# EAGLE design moth_v2 (EAGLE 9.4.1)
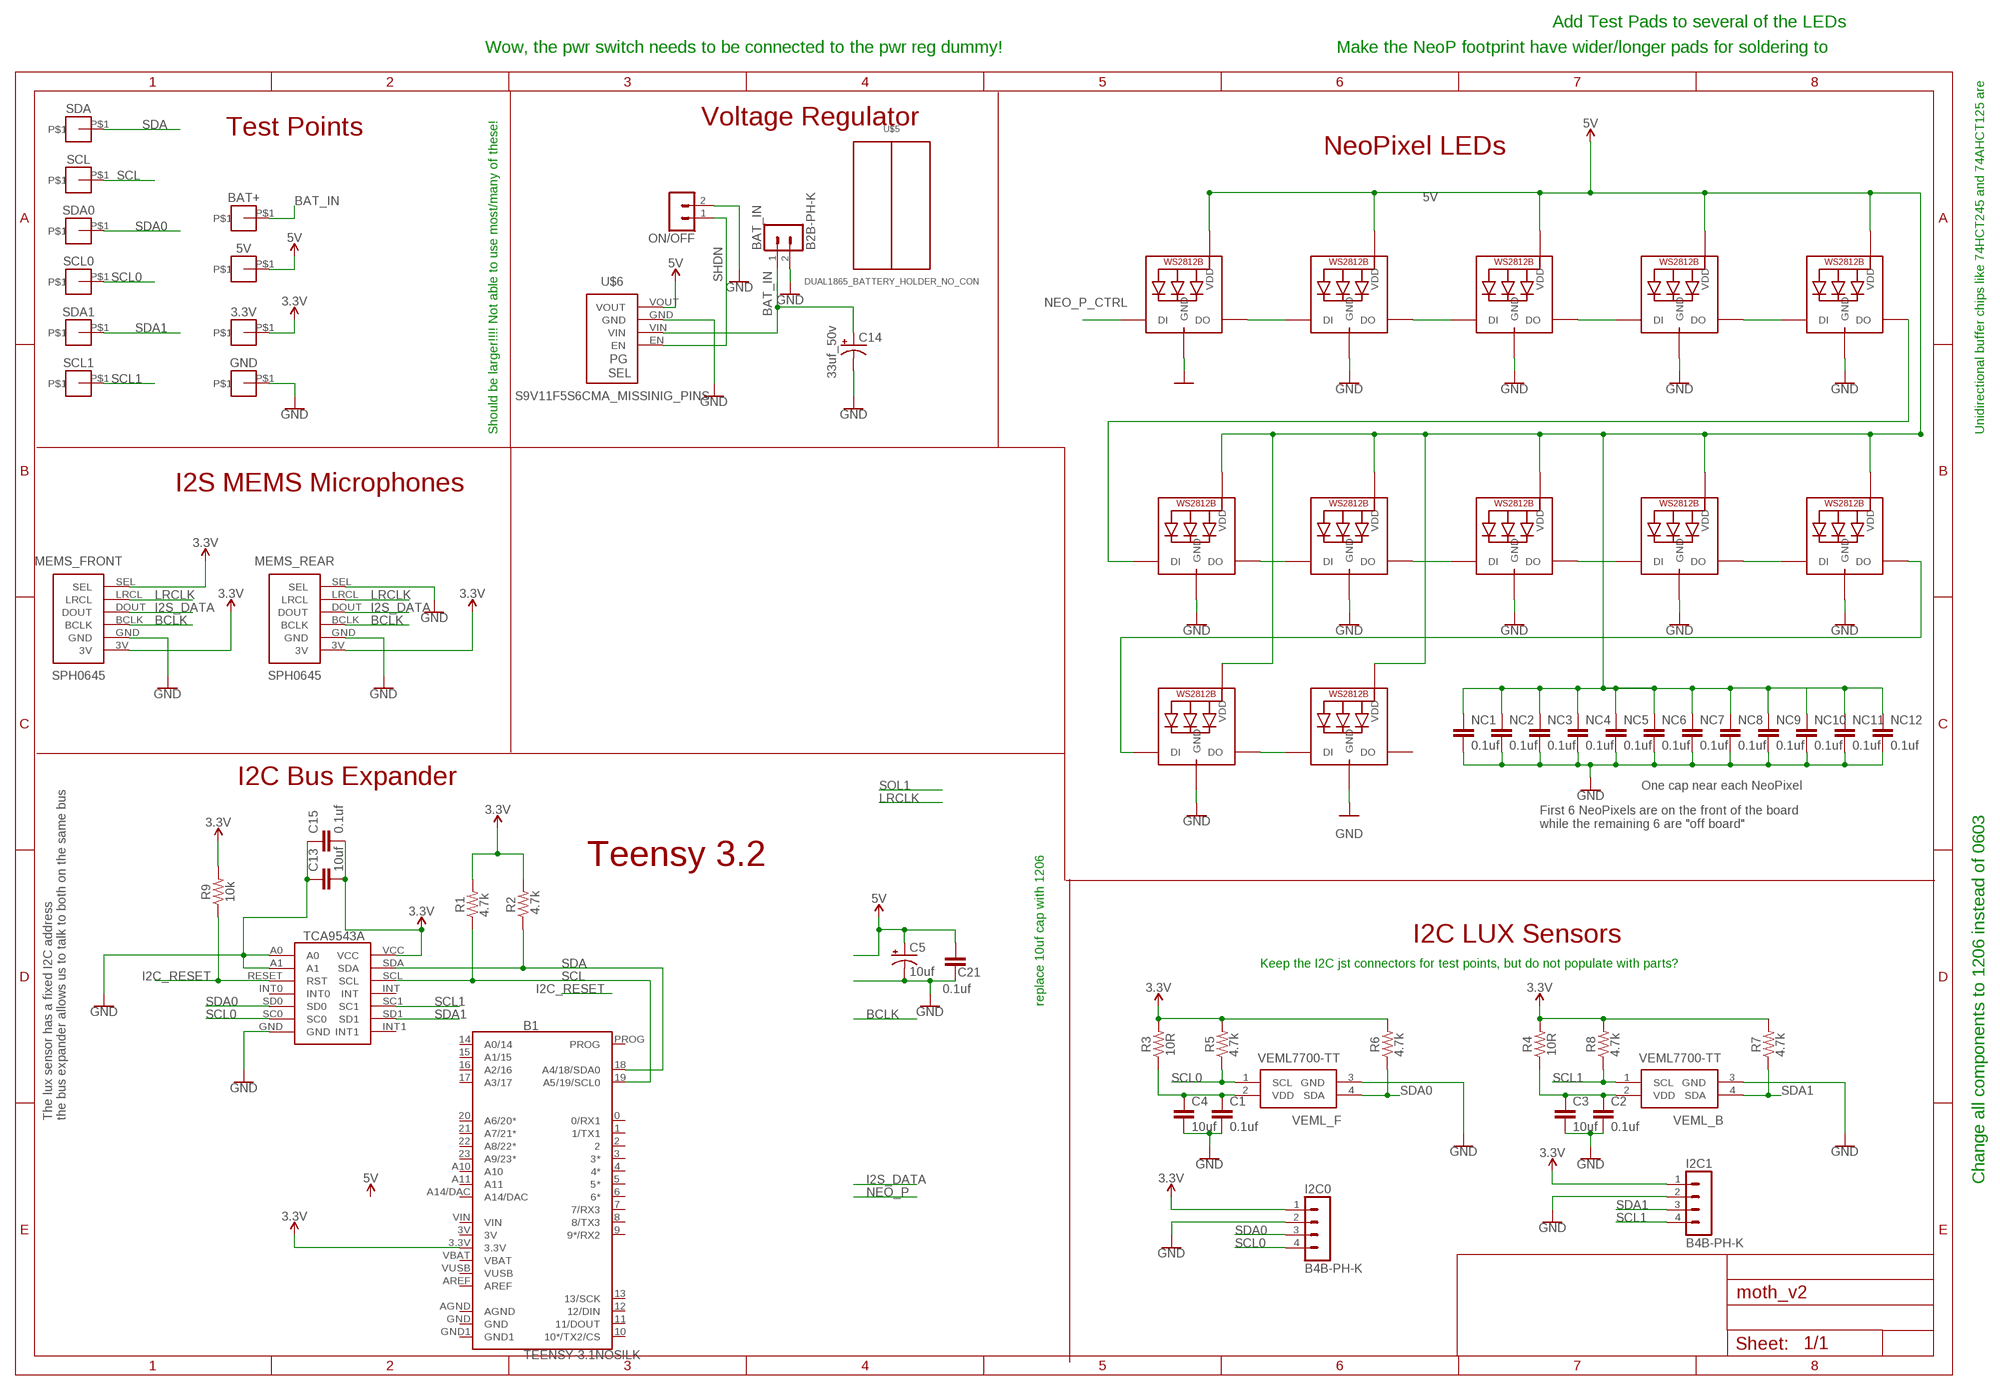
[diagram p0: schematic, sheet 1]

## Parts
3.3V  TEST_POINT_LARGE  [TEST_POINT_LARGE]
5V  TEST_POINT_LARGE  [TEST_POINT_LARGE]
B1  TEENSY-3.1NOSILK  [TEENSY-3.1_NOSILK]
BAT+  TEST_POINT_LARGE  [TEST_POINT_LARGE]
BAT_IN  B2B-PH-K  [B2B-PH-K]
C1  0.1uf  5.6PF-0603-50V-5%  [0603]
C2  0.1uf  5.6PF-0603-50V-5%  [0603]
C3  10uf  5.6PF-0603-50V-5%  [0603]
C4  10uf  5.6PF-0603-50V-5%  [0603]
C5  10uf  CPOL-USE2.5-6  [E2,5-6]
C13  10uf  5.6PF-0603-50V-5%  [0603]
C14  33uf_50v  CPOL-USE2-5  [E2-5]
C15  0.1uf  5.6PF-0603-50V-5%  [0603]
C21  0.1uf  5.6PF-0603-50V-5%  [0603]
GND  TEST_POINT_LARGE  [TEST_POINT_LARGE]
I2C0  B4B-PH-K  [B4B-PH-K]
I2C1  B4B-PH-K  [B4B-PH-K]
MEMS_FRONT  SPH0645  SPH0645_MEMS_MICROPHONE  [SPH0645]
MEMS_REAR  SPH0645  SPH0645_MEMS_MICROPHONE  [SPH0645]
NC1  0.1uf  5.6PF-0603-50V-5%  [0603]
NC2  0.1uf  5.6PF-0603-50V-5%  [0603]
NC3  0.1uf  5.6PF-0603-50V-5%  [0603]
NC4  0.1uf  5.6PF-0603-50V-5%  [0603]
NC5  0.1uf  5.6PF-0603-50V-5%  [0603]
NC6  0.1uf  5.6PF-0603-50V-5%  [0603]
NC7  0.1uf  5.6PF-0603-50V-5%  [0603]
NC8  0.1uf  5.6PF-0603-50V-5%  [0603]
NC9  0.1uf  5.6PF-0603-50V-5%  [0603]
NC10  0.1uf  5.6PF-0603-50V-5%  [0603]
NC11  0.1uf  5.6PF-0603-50V-5%  [0603]
NC12  0.1uf  5.6PF-0603-50V-5%  [0603]
NEO_01  WS2812B_5050N  [WS2812B-NARROW]
NEO_02  WS2812B_5050N  [WS2812B-NARROW]
NEO_03  WS2812B_5050N  [WS2812B-NARROW]
NEO_04  WS2812B_5050N  [WS2812B-NARROW]
NEO_05  WS2812B_5050N  [WS2812B-NARROW]
NEO_06  WS2812B_5050N  [WS2812B-NARROW]
NEO_07  WS2812B_5050N  [WS2812B-NARROW]
NEO_08  WS2812B_5050N  [WS2812B-NARROW]
NEO_09  WS2812B_5050N  [WS2812B-NARROW]
NEO_10  WS2812B_5050N  [WS2812B-NARROW]
NEO_11  WS2812B_5050N  [WS2812B-NARROW]
NEO_12  WS2812B_5050N  [WS2812B-NARROW]
ON/OFF  B2B-PH-K  [B2B-PH-K]
R1  4.7k  R-US_0207/10  [0207/10]
R2  4.7k  R-US_0207/10  [0207/10]
R3  10R  4.7KOHM-0603-1/10W-1%  [0603]
R4  10R  4.7KOHM-0603-1/10W-1%  [0603]
R5  4.7k  R-US_0207/10  [0207/10]
R6  4.7k  R-US_0207/10  [0207/10]
R7  4.7k  R-US_0207/10  [0207/10]
R8  4.7k  R-US_0207/10  [0207/10]
R9  10k  R-US_0207/10  [0207/10]
SCL  TEST_POINT_LARGE  [TEST_POINT_LARGE]
SCL0  TEST_POINT_LARGE  [TEST_POINT_LARGE]
SCL1  TEST_POINT_LARGE  [TEST_POINT_LARGE]
SDA  TEST_POINT_LARGE  [TEST_POINT_LARGE]
SDA0  TEST_POINT_LARGE  [TEST_POINT_LARGE]
SDA1  TEST_POINT_LARGE  [TEST_POINT_LARGE]
U$1  TCA9543A  [SO14]
U$5  DUAL1865_BATTERY_HOLDER_NO_CON  [DUAL_18650_BAT_HOLDER_NO_CON]
U$6  S9V11F5S6CMA_MISSINIG_PINS  [S9V11F3S5CMA_MISSING_PINS]
VEML_B  VEML7700-TT  [VEML7700]
VEML_F  VEML7700-TT  [VEML7700]

## Nets
3.3V: 3.3V.P$1 B1.3.3V C13.2 C15.2 I2C0.1 I2C1.1 MEMS_FRONT.3V MEMS_FRONT.SEL MEMS_REAR.3V R1.2 R2.2 R3.2 R4.2 R5.2 R6.2 R7.2 R8.2 R9.2 U$1.VCC
5V: 5V.P$1 C5.+ C21.2 NC1.1 NC2.1 NC3.1 NC4.1 NC5.1 NC6.1 NC7.1 NC8.1 NC9.1 NC10.1 NC11.1 NC12.1 NEO_01.1-VDD(VDD) NEO_02.1-VDD(VDD) NEO_03.1-VDD(VDD) NEO_04.1-VDD(VDD) NEO_05.1-VDD(VDD) NEO_06.1-VDD(VDD) NEO_07.1-VDD(VDD) NEO_08.1-VDD(VDD) NEO_09.1-VDD(VDD) NEO_10.1-VDD(VDD) NEO_11.1-VDD(VDD) NEO_12.1-VDD(VDD) U$6.VOUT
BAT_IN: BAT+.P$1 BAT_IN.1 C14.+ U$6.VIN
BCLK: MEMS_FRONT.BCLK MEMS_REAR.BCLK
GND: BAT_IN.2 C1.2 C2.2 C3.2 C4.2 C5.- C13.1 C14.- C15.1 C21.1 GND.P$1 I2C0.2 I2C1.2 MEMS_FRONT.GND MEMS_REAR.GND MEMS_REAR.SEL NC1.2 NC2.2 NC3.2 NC4.2 NC5.2 NC6.2 NC7.2 NC8.2 NC9.2 NC10.2 NC11.2 NC12.2 NEO_01.3-GND(GND) NEO_02.3-GND(GND) NEO_03.3-GND(GND) NEO_04.3-GND(GND) NEO_05.3-GND(GND) NEO_06.3-GND(GND) NEO_07.3-GND(GND) NEO_08.3-GND(GND) NEO_09.3-GND(GND) NEO_10.3-GND(GND) NEO_11.3-GND(GND) NEO_12.3-GND(GND) ON/OFF.2 U$1.A0 U$1.A1 U$1.GND U$6.GND VEML_B.3(GND) VEML_F.3(GND)
I2C_RESET: R9.1 U$1.RESET(RST)
I2S_DATA: MEMS_FRONT.DOUT MEMS_REAR.DOUT
LRCLK: MEMS_FRONT.LRCL MEMS_REAR.LRCL
N$1: C1.1 C4.1 R3.1 VEML_F.2(VDD)
N$2: C2.1 C3.1 R4.1 VEML_B.2(VDD)
N$4: NEO_02.2-DOUT(DO) NEO_03.4-DIN(DI)
N$5: NEO_05.2-DOUT(DO) NEO_06.4-DIN(DI)
N$6: NEO_11.2-DOUT(DO) NEO_12.4-DIN(DI)
N$8: NEO_04.2-DOUT(DO) NEO_05.4-DIN(DI)
N$10: NEO_03.2-DOUT(DO) NEO_04.4-DIN(DI)
N$11: NEO_07.2-DOUT(DO) NEO_08.4-DIN(DI)
N$12: NEO_08.2-DOUT(DO) NEO_09.4-DIN(DI)
N$13: NEO_09.2-DOUT(DO) NEO_10.4-DIN(DI)
N$14: NEO_10.2-DOUT(DO) NEO_11.4-DIN(DI)
N$23: NEO_06.2-DOUT(DO) NEO_07.4-DIN(DI)
NEO_P1: NEO_01.2-DOUT(DO) NEO_02.4-DIN(DI)
NEO_P_CTRL: NEO_01.4-DIN(DI)
SCL: B1.19(A5/19/SCL0) R1.1 SCL.P$1 U$1.SCL
SCL0: I2C0.4 R5.1 SCL0.P$1 U$1.SC0 VEML_F.1(SCL)
SCL1: I2C1.4 R8.1 SCL1.P$1 U$1.SC1 VEML_B.1(SCL)
SDA: B1.18(A4/18/SDA0) R2.1 SDA.P$1 U$1.SDA
SDA0: I2C0.3 R6.1 SDA0.P$1 U$1.SD0 VEML_F.4(SDA)
SDA1: I2C1.3 R7.1 SDA1.P$1 U$1.SD1 VEML_B.4(SDA)
SHDN: ON/OFF.1 U$6.EN
Unconnected: B1.0(0/RX1) B1.1(1/TX1) B1.2 B1.3(3*) B1.4(4*) B1.5(5*) B1.6(6*) B1.7(7/RX3) B1.8(8/TX3) B1.9(9*/RX2) B1.10(10*/TX2/CS) B1.11(11/DOUT) B1.12(12/DIN) B1.13(13/SCK) B1.14(A0/14) B1.15(A1/15) B1.16(A2/16) B1.17(A3/17) B1.20(A6/20*) B1.21(A7/21*) B1.22(A8/22*) B1.23(A9/23*) B1.A10 B1.A11 B1.A14/DAC B1.AREF B1.PROG NEO_12.2-DOUT(DO) U$1.INT U$1.INT0 U$1.INT1

## Notes on the sheet
- Add Test Pads to several of the LEDs
- Wow, the pwr switch needs to be connected to the pwr reg dummy! | Make the NeoP footprint have wider/longer pads for soldering to
- Voltage Regulator
- Test Points
- NeoPixel LEDs
- Should be larger!!!! Not able to use most/many of these! | Unidirectional buffer chips like 74HCT245 and 74AHCT125 are
- I2S MEMS Microphones
- I2C Bus Expander
- One cap near each NeoPixel
- First 6 NeoPixels are on the front of the board
  while the remaining 6 are "off board"
- Teensy 3.2
- 10k
- 4.7k | 4.7k
- I2C LUX Sensors
- Keep the I2C jst connectors for test points, but do not populate with parts?
- replace 10uf cap with 1206
- 4.7k | 4.7k | 4.7k | 4.7k
- The lux sensor has a fixed I2C address
  the bus expander allows us to talk to both on the same bus
- Change all components to 1206 instead of 0603

## Power pins joined to a net without a drawn wire
3V: B1.3V
AGND: B1.AGND
GND: B1.GND
GND1: B1.GND1
VBAT: B1.VBAT
VIN: B1.VIN
VUSB: B1.VUSB

## Library data of the parts
3.3V 5V BAT+ GND SCL SCL0 SCL1 SDA SDA0 SDA1 = nathans-custom-parts:TEST_POINT_LARGE
B1 = SparkFun-Boards:TEENSY-3.1: Teensy 3+ Footprint Mechanical footprint with connectors for Teensy Development Board with ARM Cortex. SparkFun Products: Teensy 3.2 <https://www.sparkfun.com/products/13736> Teensy LC <https://www.sparkfun.com/products/13305>; SF_ID: DEV-12646
BAT_IN ON/OFF = con-jst-ph:B2B-PH-K: HEADER
C1-C4 C13 C15 C21 NC1-NC12 = SparkFun-Capacitors:5.6PF: 5.6pF ceramic capacitors A capacitor is a passive two-terminal electrical component used to store electrical energy temporarily in an electric field.; PROD_ID: CAP-12456; VALUE: 5.6PF
C5 C14 = adafruit:CPOL-US: POLARIZED CAPACITOR, American symbol
I2C0 I2C1 = con-jst-ph:B4B-PH-K: HEADER
MEMS_FRONT MEMS_REAR = nathans-custom-parts:SPH0645_MEMS_MICROPHONE
NEO_01-NEO_09 NEO_10-NEO_12 = adafruit:WS2812B
R1 R2 R5-R9 = adafruit:R-US_: RESISTOR, American symbol
R3 R4 = SparkFun-Resistors:4.7KOHM: 4.7kΩ resistor A resistor is a passive two-terminal electrical component that implements electrical resistance as a circuit element. Resistors act to reduce current flow, and, at the same time, act to lower voltage levels within circuits. - Wikipedia; PROD_ID: RES-07857; VALUE: 4.7k
U$1 = nathans-custom-parts:TCA9543A
U$5 = nathans-custom-parts:DUAL1865_BATTERY_HOLDER_NO_CON
U$6 = nathans-custom-parts:S9V11F5S6CMA_MISSINIG_PINS
VEML_B VEML_F = VEML7700-TT:VEML7700-TT: 16Bit Ambient Light Sensor I2C 6.8x2.3mm Source: Datasheet <https://www.arrow.com/en/products/veml7700-tt/vishay>; DESCRIPTION: 16Bit Ambient Light Sensor I2C 6.8x2.3mm; HEIGHT: mm; MANUFACTURER_NAME: Vishay; MANUFACTURER_PART_NUMBER: VEML7700-TT; MOUSER_PART_NUMBER: 78-VEML7700-TT; MOUSER_PRICE-STOCK: https://www.mouser.com/Search/Refine.aspx?Keyword=78-VEML7700-TT; RS_PART_NUMBER: 1226791P; RS_PRICE-STOCK: http://uk.rs-online.com/web/p/products/1226791P

## Net classes
0 default: width 0.203 mm, drill 0.254 mm, clearance 0.203 mm

## Board
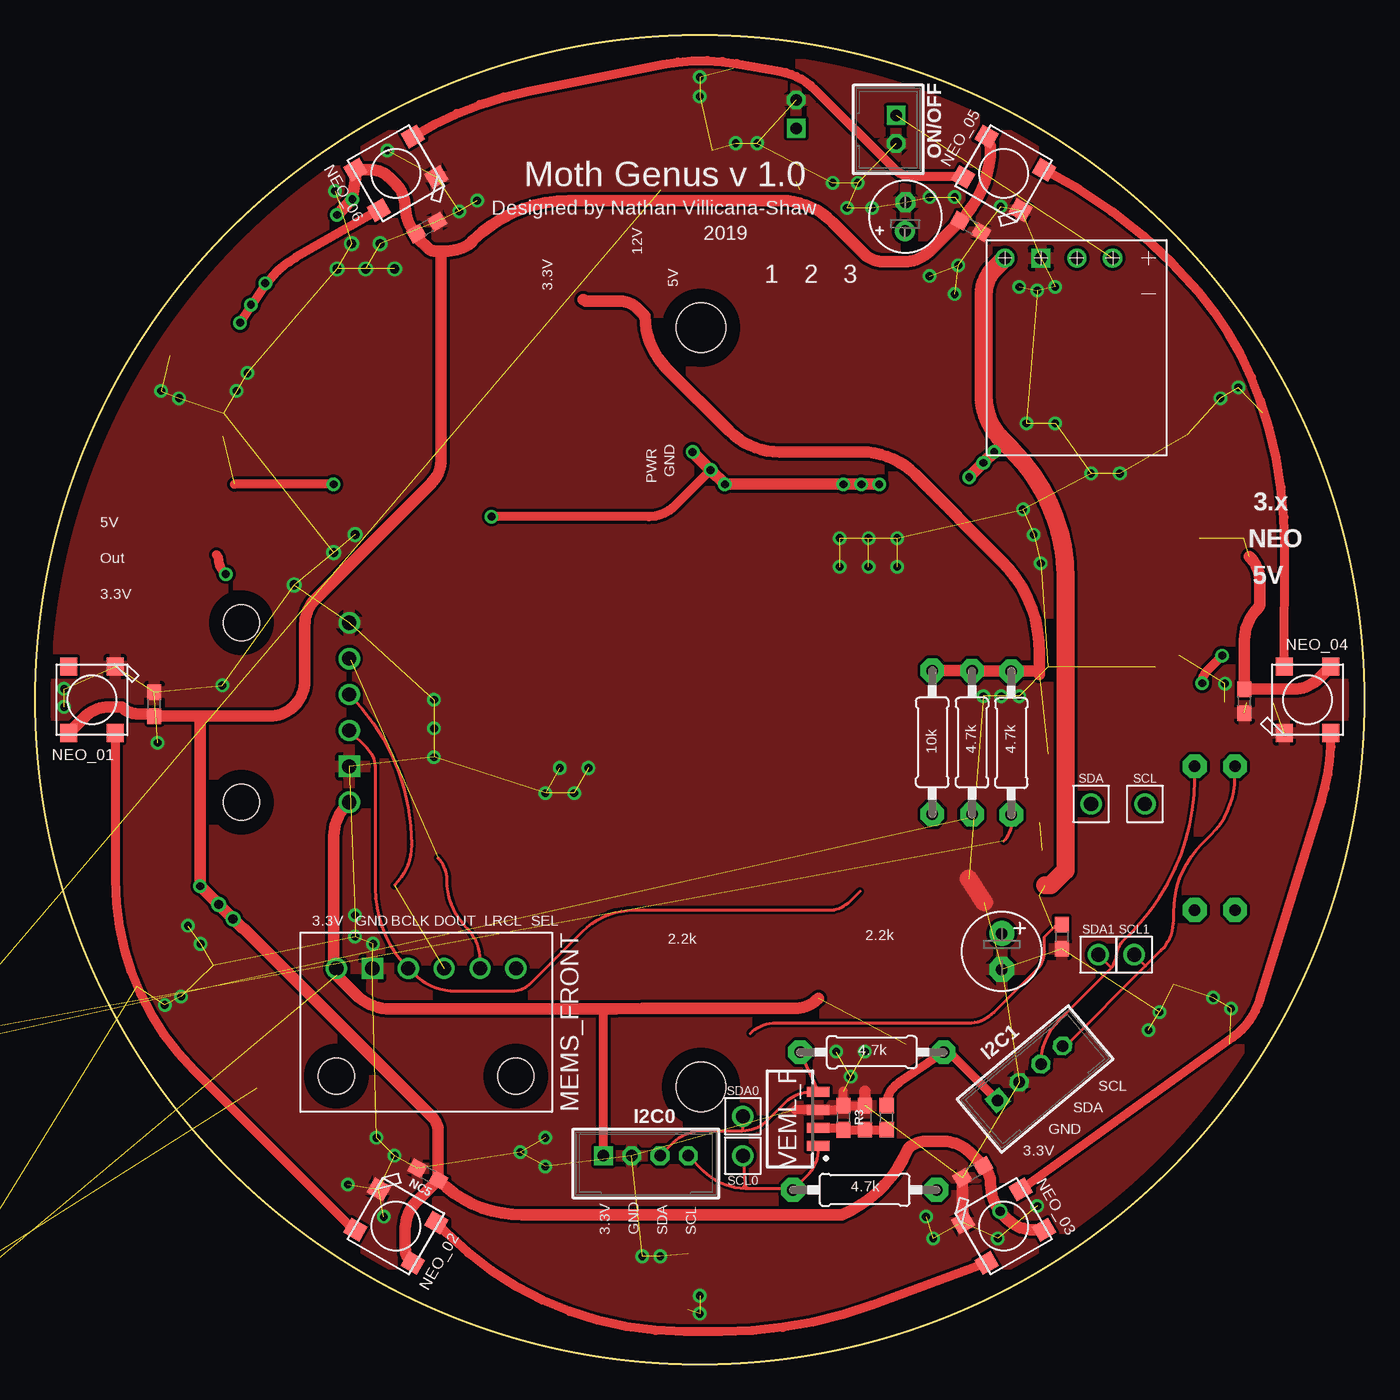
[diagram p1: board, top side]
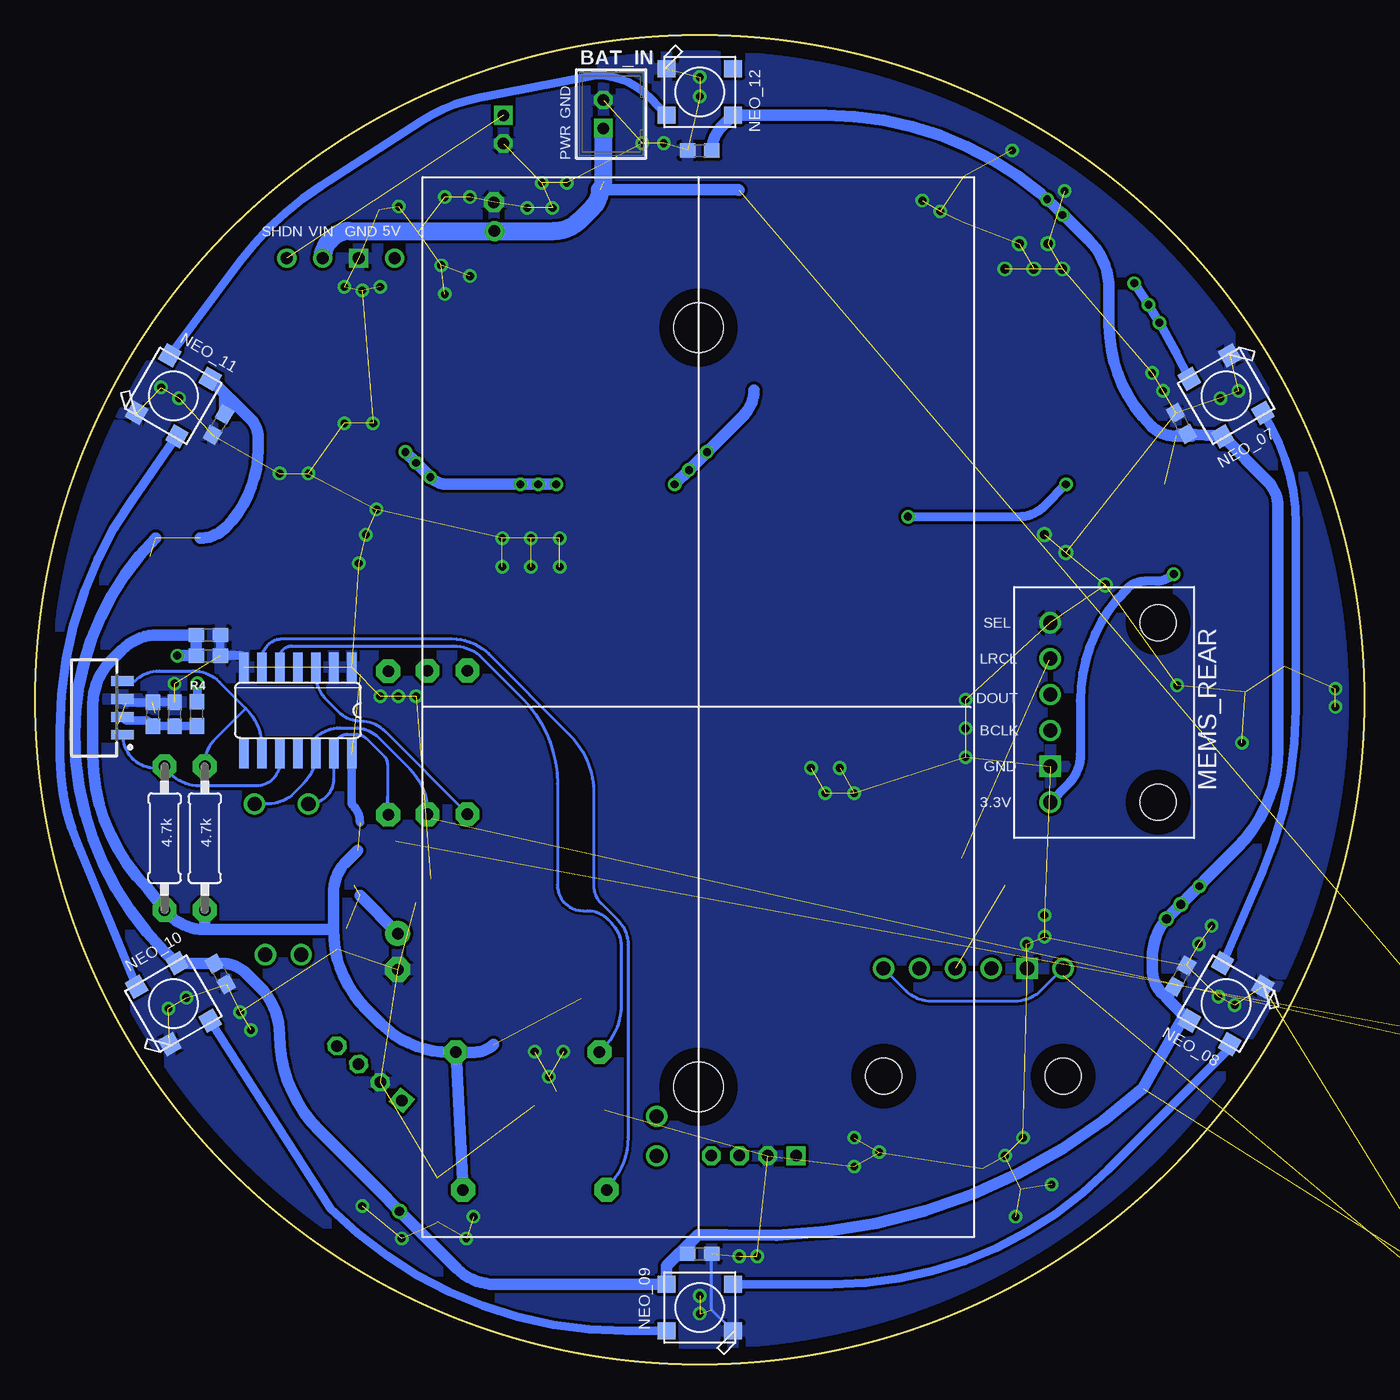
[diagram p2: board, bottom side, seen from below]

Size 94 x 94 mm. Coordinates in mm from the lower left corner, seen from the top.
Outline: circle at 47,47 radius 47
Copper layers (1*16): Top 0.035mm / dielectric 1.5mm / Bottom 0.035mm
Design rules "PCBway *": minimum track width 6mil, minimum drill 0.3mm, track to track 0.205mm, track to pad 0.205mm, pad to pad 0.205mm, via to via 0.205mm, smd to smd 8mil, copper to edge 40mil, drill to drill 8mil, minimum pad ring 10mil, minimum via ring 8mil, stop-mask expansion 4mil, vias tented up to drill 25mil, thermal gap 10mil

### Footprints (pad centres in the part's own frame; a part is rotated, then mirrored left to right if it is on the bottom)
TEST_POINT_LARGE = drill 1: P$1 0,0
TEENSY-3.1_NOSILK = drill 1.016 pad 1.88: 0 7.62,-13.97; 1 7.62,-11.43; 2 7.62,-8.89; 3 7.62,-6.35; 3.3V 2.54,16.51; 3V -7.62,-11.43; 4 7.62,-3.81; 5 7.62,-1.27; 6 7.62,1.27; 7 7.62,3.81; 8 7.62,6.35; 9 7.62,8.89; 10 7.62,11.43; 11 7.62,13.97; 12 7.62,16.51; 13 -7.62,16.51; 14 -7.62,13.97; 15 -7.62,11.43; 16 -7.62,8.89; 17 -7.62,6.35; 18 -7.62,3.81; 19 -7.62,1.27; 20 -7.62,-1.27; 21 -7.62,-3.81; 22 -7.62,-6.35; 23 -7.62,-8.89; A10 -5.08,-6.35; A11 -5.08,-3.81; A14/DAC -5.08,16.51; AGND -7.62,-13.97; AREF -5.08,-8.89; GND 0,16.51; GND1 7.62,-16.51; PROG -2.54,16.51; VBAT 5.08,16.51; VIN -7.62,-16.51; VUSB -5.08,-13.97
B2B-PH-K = drill 0.813 square: 1 -1,0 | drill 0.813 octagon: 2 1,0
0603 = smd 1.1 x 1: 1 -0.85,0; 2 0.85,0
E2,5-6 = drill 0.813 pad 1.778: + -1.27,0 | drill 0.813 pad 1.778 octagon: - 1.27,0
E2-5 = drill 0.813 pad 1.422: + -1.016,0 | drill 0.813 pad 1.422 octagon: - 1.016,0
B4B-PH-K = drill 0.813 square: 1 -3,0 | drill 0.813 octagon: 2 -1,0; 3 1,0; 4 3,0
SPH0645 = drill 1: 3V 12.7,0; BCLK 7.62,0; DOUT 5.08,0; LRCL 2.54,0; SEL 0,0 | drill 1 square: GND 10.16,0 | hole 2.54: 0,7.62; 12.7,7.62
WS2812B-NARROW = smd 1.3 x 1.2: 1-VDD 2.35,-1.65; 2-DOUT 2.35,1.65; 3-GND -2.35,1.65; 4-DIN -2.35,-1.65
0207/10 = drill 0.813 pad 1.676 octagon: 1 -5.08,0; 2 5.08,0
SO14 = smd 0.66 x 2.032: A0 -3.81,-3.073; A1 -2.54,-3.073; GND 3.81,-3.073; INT 0,3.073; INT0 0,-3.073; INT1 3.81,3.073; RESET -1.27,-3.073; SC0 2.54,-3.073; SC1 1.27,3.073; SCL -1.27,3.073; SD0 1.27,-3.073; SD1 2.54,3.073; SDA -2.54,3.073; VCC -3.81,3.073
DUAL_18650_BAT_HOLDER_NO_CON = hole 3.5: 19.674,64.255; 19.674,10.555
S9V11F3S5CMA_MISSING_PINS = drill 0.85: EN 0,0; VIN 2.54,0; VOUT 7.62,0 | drill 0.85 square: GND 5.08,0
VEML7700 = smd 0.7 x 1.6: 1 1.495,-0.4; 2 2.765,-0.4; 3 4.035,-0.4; 4 5.305,-0.4

### Placement (x,y rotation side)
3.3V  -20.06,-7.1 0 top  (outside the outline)
5V  -26.41,-7.1 0 top  (outside the outline)
B1  -46.22,10.68 0 top  (outside the outline)
BAT+  -32.76,-7.1 0 top  (outside the outline)
BAT_IN  53.82,88.43 90 bottom
C1  58.69,17.43 90 top
C2  85.68,45.99 90 bottom
C3  84.13,45.99 90 bottom
C4  57.16,17.42 90 top
C5  68.36,29.19 270 top
C13  81.76,50.11 180 bottom
C14  61.53,81.17 89 top
C15  81.76,51.58 180 bottom
C21  72.61,30.24 90 top
GND  -13.71,-7.1 0 top  (outside the outline)
I2C0  43.19,14.74 0 top
I2C1  70.37,20.58 40 top
MEMS_FRONT  34,28 180 top
MEMS_REAR  22.21,52.45 270 bottom
NC1  85.53,46.91 270 top
NC2  66.17,80.48 331 top
NC3  27.69,80.4 30 top
NC4  8.42,46.69 90 top
NC5  27.76,13.44 151 top
NC6  66.31,13.6 210 top
NC7  81.04,66.47 240 bottom
NC8  47,85.86 180 bottom
NC9  12.93,66.55 119 bottom
NC10  12.99,27.46 60 bottom
NC11  47.01,7.81 0 bottom
NC12  80.92,27.61 300 bottom
NEO_01  4,47 270 top
NEO_02  25.5,9.76 330 top
NEO_03  68.5,9.76 30 top
NEO_04  90,47 90 top
NEO_05  68.5,84.24 150 top
NEO_06  25.5,84.24 210 top
NEO_07  9.76,68.5 300 bottom
NEO_08  9.76,25.5 240 bottom
NEO_09  47,4 180 bottom
NEO_10  84.24,25.5 120 bottom
NEO_11  84.24,68.5 60 bottom
NEO_12  47,90 0 bottom
ON/OFF  60.89,87.35 270 top
R1  66.26,43.97 90 top
R2  69.04,43.94 90 top
R3  60.22,17.45 90 top
R4  82.57,45.99 90 bottom
R5  58.67,12.33 0 top
R6  59.17,22.07 0 top
R7  82.02,37.21 270 bottom
R8  84.86,37.21 270 bottom
R9  63.45,43.99 90 top
SCL  78.5,39.63 0 top
SCL0  50.05,14.74 0 top
SCL1  77.73,28.97 0 top
SDA  74.69,39.63 0 top
SDA0  50.05,17.54 0 top
SDA1  75.19,28.97 0 top
U$1  75.43,46.24 180 bottom
U$5  27.42,83.88 180 bottom
U$6  76.21,78.24 180 top
VEML_B  88.23,43.03 90 bottom
VEML_F  54.98,13.95 90 top

### Tracks (layer width: path | path; a pad name or v marks a point on that pad's centre or on a via)
3.3V  (via drill 0.55)  (5 unrouted)
  Top 0.635: R3.2 arc-56 61.06,19.88 R6.2 64.66,22.07 I2C1.1 | 82.93,49.1 arc45 v82.55,48.17 arc-45 82.93,49.1 | 82.93,49.1 v83.96,50.12 | 12.82,57.25 arc-45 12.96,56.91 arc45 13.32,56.04 v13.47,55.89 | I2C0.1 40.19,25.13 39.15,25.13 39.14,25.14
  Top 0.813: MEMS_REAR.3V 22.04,39.58 arc45 21.11,37.33 21.11,28.19 MEMS_FRONT.3V 21.3,27.52 22.66,26.16 arc45 25.14,25.13 39.15,25.13 | 39.14,25.14 41.08,25.14 42.97,25.17 53.69,25.17 arc45 55.38,25.87 | 38.75,75.32 arc45 39.05,75.19 41.37,75.19 arc-45 42.57,74.7 43.13,74.14 arc45 44.66,70.44 49.09,66.01 arc45 52.67,64.53 58.42,64.53 arc-45 62.22,62.96 68.34,56.83 arc-45 71.04,50.31 71.04,48.78 70.8,49.02 R2.2 69.01,49.05 R1.2 66.24,49.07 R9.2
  Bottom 0.203: MEMS_FRONT.3V 22.89,26.41 arc45 24.69,25.66 30.61,25.66 arc45 32.41,26.41 MEMS_FRONT.SEL
  Bottom 0.61: U$1.VCC 71.62,39.71 arc-45 71.55,39.54 arc45 71.04,38.32
  Bottom 0.635: R4.2 arc-45 82.56,46.87 82.56,48.14 arc45 v82.55,48.17 | v13.47,55.89 arc45 14.7,55.38 15.5,55.38 arc-45 16.8,54.84 arc-45 20.08,46.95 20.08,43.13 arc45 20.96,40.99 MEMS_REAR.3V
  Bottom 0.813: 64.26,22.06 R6.2 arc45 R6.2 | 71.2,36.35 71.95,35.61 arc-45 72.91,33.29 72.91,30.74 | 72.91,30.74 arc-45 70.57,25.11 69.54,24.07 arc-45 64.71,22.07 R6.2 | R6.2 62.93,22.07 arc-45 61.57,22.63 | v83.96,50.12 83.94,50.11 C13.2 arc45 C13.2 C15.2 85.33,51.58 arc-45 87.89,50.52 88.65,49.76 arc-45 89.93,46.69 89.93,43.03 arc-45 86.05,33.66 R8.2 84.48,31.75 arc-45 82.05,30.74 | 72.91,30.74 82.05,30.74 | R7.2 82.02,30.78 82.05,30.74 | R6.2 R5.2
5V  (via drill 0.55, 0.65)  (6 unrouted)
  Top 0.203: 50.57,23.4 arc-45 52.37,24.14 66.01,24.14 arc45 67.81,24.88 70.88,27.95 arc45 71.38,29.18 71.38,30.24 71.98,30.83 arc-45 C21.2 | v68.25,10.8 68.51,10.51
  Top 0.635: v47.76,63.26 45.2,60.7 arc-45 43.41,59.95 v32.27,59.95 | v21.09,62.24 14.09,62.24
  Top 0.813: 72.94,53.53 72.87,53.6 | v66.05,62.75 v67.07,63.76 v67.83,64.53 68.23,64.93 arc45 68.41,65.36 | v46.49,64.53 v47.76,63.26 v48.78,62.24 v57.16,62.24 v58.43,62.24 v59.7,62.24 | NEO_01.1-VDD 3.45,45.75 arc-45 5.24,46.49 6.11,46.49 arc45 7.33,45.98 8.06,45.98 arc-45 NC4.1 11.67,45.84 | 28.71,78.75 29.18,78.75 arc45 30.98,79.49 arc-45 37.77,82.31 52.74,82.31 arc-45 56.38,80.8 58.65,78.53 arc45 59.95,77.99 61.47,77.99 arc45 63.27,78.73 NC2.1 arc45 67.57,86.08 67.57,86.16 NEO_05.1-VDD | 28.71,78.75 28.2,78.75 arc-45 27.77,78.93 27.11,79.59 arc-45 NC3.1 arc-45 26.17,81.85 arc45 25.49,83.49 25.06,83.93 arc45 23.7,84.49 NEO_06.1-VDD 22.64,83.9 v22.43,82.41 v21.35,81.29 | NC5.1 26.92,11.44 arc45 26.17,9.64 26.17,8.14 arc45 26.48,7.38 NEO_02.1-VDD | v11.66,33.8 11.67,33.82 | 11.67,33.82 v12.96,32.52 v13.98,31.51 14.67,30.82 14.73,30.82 28.07,17.48 arc-45 28.5,16.44 NC5.1 | 11.67,45.84 11.67,33.82 | NC5.1 arc45 34.44,10.56 57.05,10.56 arc45 61.71,15.23 arc-45 62.98,15.76 64.26,15.76 arc-45 66.06,15.01 NC6.1 arc-45 67.57,12.76 arc45 68.51,10.51 68.76,10.25 arc45 70.56,9.51 NEO_03.1-VDD | 85.88,57.14 arc-45 86.62,55.35 86.62,53.86 arc-45 86.44,53.42 arc45 85.53,51.22 NC1.1 89,47.76 arc45 90.8,48.5 NEO_04.1-VDD | 28.71,78.75 28.71,64.05 arc-45 27.97,62.26 19.8,54.09 arc45 19.06,52.3 19.06,48.38 arc-90 16.52,45.84 11.67,45.84
  Top 1.27: 71.43,33.88 71.45,33.87 71.81,33.87 72.87,34.92 72.87,53.6 72.87,55.52 arc45 69.07,64.7 68.41,65.36 arc-45 67.09,68.53 67.09,75.69 arc-45 67.84,77.49 U$6.VOUT
  Bottom 0.635: v32.27,59.95 24.43,59.95 arc-45 22.63,60.7 v21.09,62.24 | v13.98,31.51 13.74,31.75 arc-45 13.72,31.79
  Bottom 0.813: C5.+ 71.04,33.14 | v48.78,62.24 v47.76,63.26 v46.49,64.53 43.91,67.11 arc-45 43.17,68.9 | v57.16,62.24 v58.43,62.24 v59.7,62.24 64.82,62.24 arc45 v66.05,62.75 v67.07,63.76 v67.83,64.53 | 82.34,58.43 arc-45 80.55,59.17 arc-45 78.24,64.74 78.24,65.57 arc-45 78.77,66.85 80.01,68.09 | 80.01,68.09 80.52,68.6 | 85.49,58.43 arc-45 91.23,44.57 arc-45 84.85,29.18 NEO_10.1-VDD arc-45 83.94,28.34 NC12.1 NC12.1 arc-45 81.29,28.36 80.78,28.36 arc45 79.12,27.67 78.11,26.66 arc45 76.72,23.31 arc-45 73.89,16.49 64.16,6.75 arc-45 61.49,5.65 NEO_09.1-VDD 49.35,6.95 47.42,8.88 | 21.35,81.4 arc-45 38.12,88.35 NEO_12.1-VDD 45.45,87.55 arc-45 NC8.1 | 80.01,68.09 arc45 80.22,67.6 NC7.1 80.61,68.38 arc45 80.52,68.6 | 21.35,81.4 19.51,79.56 arc45 18.04,76.03 18.04,73.55 arc-45 15.08,66.38 arc-45 13.28,65.64 | 13.28,65.64 12.2,65.64 arc45 12.46,65.75 NC9.1 | NC11.1 arc45 47.42,8.88 | 47.42,8.88 47.14,9.15 45.15,9.15 arc-45 15.64,19.51 13.72,22.93 12.72,24.64 NEO_08.1-VDD 13.86,25.78 | NC10.1 13.51,26.62 arc-45 13.86,25.78 | NC9.1 12.88,65.8 arc-45 13.28,65.64 | NC9.1 NEO_07.1-VDD 6.85,62.48 arc45 6.11,60.68 6.11,43.46 arc45 8.97,36.54 13.72,31.79 arc-45 15,28.71 15,27.97 arc-45 14.25,26.18 13.86,25.78 | 80.52,68.6 NEO_11.1-VDD | v21.35,81.29 21.35,81.4
BAT_IN  (2 unrouted)
  Bottom 0.813: 44.23,83.05 arc-45 44.27,83.07 54.06,83.07 | C14.+ 60.94,80.16
  Bottom 1.27: 54.06,83.07 arc45 54.56,81.85 55.52,80.9 arc45 57.31,80.16 C14.+ 71.82,80.16 arc-45 73.01,79.67 73.13,79.54 arc-45 U$6.VIN | 53.82,83.65 BAT_IN.1
BCLK
  Top 0.203: 58.34,33.45 57.64,32.75 arc-45 56.11,32.12 42.36,32.12 arc45 38.71,30.6 35.04,26.94 arc-45 33.74,26.4 29.7,26.4 arc-45 26.76,27.62 MEMS_FRONT.BCLK arc-45 24.04,33.65 24.04,42.17 arc45 23.45,43.58 MEMS_REAR.BCLK
GND  (via drill 0.55, 0.65)  (132 unrouted)
  Top 0.203: 58.67,18.27 arc45 C1.2
  Top 0.635: 58.68,18.27 C1.2 | 53.75,17.98 VEML_F.3 56.46,17.98 arc45 C4.2 | C4.2 58.67,18.27 | C4.2 arc-45 57.16,18.28 57.16,19.31
  Top 0.813: NEO_03.3-GND 65.58,10.08 NC6.2 | C1.2 arc-45 C1.2 58.68,19.31
  Top 1.27: 66.04,34.34 67.12,32.67
  Bottom 0.203: NEO_09.3-GND 46.16,3.86 NC11.2
  Bottom 0.61: VEML_B.3 87.57,46.81 85.71,46.81 C2.2 C3.2 | C15.1 80.92,51.57 C13.1
  Bottom 0.635: U$1.GND arc45 79.26,49.36 79.26,50.05 arc-45 79.41,50.11 C13.1
  other vias: 83.32,25.92 84.59,25.16 79.51,24.9 78.75,23.63 44.21,7.63 42.94,7.63 47,4.84 47,3.57 11.69,29.73 10.31,26.01 9.15,25.41 10.79,31.01 8.9,68.84 10.17,68.34 14.23,68.84 15,70.11 47,91.04 47,89.67 49.54,86.37 51.06,86.37 69.61,76.21 70.88,75.96 72.15,76.21 83.83,68.34 85.1,69.1 2.04,47.76 2.04,46.49 8.65,43.95 13.22,48.02 25.41,14.74 24.14,16.01 22.11,12.71 24.65,10.42 24.9,85.86 21.19,82.99 29.98,81.54 31.25,82.31 56.4,83.58 68.29,81.89 63.26,76.97 65.29,77.73 70.88,11.19 68.08,8.9 63,10.42 63.51,8.9 67.07,47.25 68.34,47.25 69.61,47.25 84.15,48.14 22.62,31.76 22.62,30.24 57.41,81.8 59.19,81.8 58.18,83.58 65.03,75.7 63.26,82.56 65.03,82.56 21.35,77.48 23.38,77.48 25.41,77.48 24.39,79.26 22.36,79.26 22.62,58.68 21.09,57.41 18.3,55.13 70.11,66.56 72.15,66.56 74.69,63 76.72,63 56.91,58.43 58.94,58.43 60.97,58.43 56.91,56.4 58.94,56.4 60.97,56.4 56.65,22.11 58.68,22.11 57.67,20.33 36.08,16.01 36.08,13.98 34.3,15 28.2,42.94 28.2,44.97 28.2,47 36.08,40.4 38.11,40.4 37.09,42.17 39.13,42.17 69.86,60.46 70.62,58.68 71.13,56.65 23.89,29.73
  pour Top: -11,96 100,96 100,-5 -11,-5
  pour Bottom: 68.77,95.9 99.91,64.75 99.91,26.93 67.65,-5.32 28.81,-5.32 -11.27,34.76 -10.96,95.92
I2C_RESET
  Top 0.203: 63.42,38.88 R9.1
  Bottom 0.203: R9.1 63.45,38.97 69.23,44.75 arc-45 70.98,45.48 arc45 72.54,46.12 73.37,46.95 arc45 74.16,48.86 U$1.RESET
I2S_DATA  (1 unrouted)
  Top 0.203: MEMS_REAR.DOUT arc-45 26.6,36.76 26.6,36.73 arc-45 25.42,33.88
LRCLK  (1 unrouted)
  Top 0.203: MEMS_FRONT.LRCL 31.46,28.61 arc45 30.55,30.82 arc-45 29.12,34.26 arc45 28.48,35.8 | MEMS_REAR.LRCL 22.32,49.8
N$1
  Top 0.635: R3.1 60.21,16.58 C1.1 57.17,16.58 C4.1 57.02,16.71 VEML_F.2
N$2
  Bottom 0.61: VEML_B.2 87.57,45.54 86.09,45.54 C2.1 84.31,45.14 84.22,45.22 C3.1 82.62,45.14 R4.1
N$4
  Top 0.635: NEO_02.2-DOUT 29.1,9.28 arc45 45.95,2.3 48.53,2.3 arc20 59.16,4.18 NEO_03.4-DIN
N$5
  Top 0.635: NEO_05.2-DOUT 62.12,83.98 arc-45 60.76,84.55 55.14,90.16 arc35 52.68,91.45 49.61,92 arc21 44.4,91.95 34.84,90.03 arc20 NEO_06.4-DIN
N$6
  Bottom 0.61: NEO_11.2-DOUT 79.49,78.02 arc20 73.8,83.33 66.7,87.94 arc22 62.6,89.59 54.37,91.2 arc46 50.5,89.55 NEO_12.4-DIN
N$8
  Top 0.635: NEO_04.2-DOUT 88.38,57.82 arc19 86.66,68.15 arc21 82.31,75.82 arc23 NEO_05.4-DIN
N$10
  Top 0.635: NEO_03.2-DOUT 84.72,23.14 arc37 86.62,25.78 90.97,39.81 arc18 NEO_04.4-DIN
N$11
  Bottom 0.61: NEO_07.2-DOUT arc33 4.84,59.39 4.84,46.32 arc24 7.26,34.7 NEO_08.4-DIN
N$12
  Bottom 0.61: NEO_08.2-DOUT 9.51,22.36 18.12,13.74 arc45 37.66,5.65 NEO_09.4-DIN
N$13
  Bottom 0.61: NEO_10.4-DIN 73.11,10.99 arc-45 52.25,2.35 NEO_09.2-DOUT
N$14
  Bottom 0.635: NEO_10.2-DOUT 90.98,36.75 arc21 92.26,42.87 92.26,44.88 arc35 87.06,61.28 NEO_11.4-DIN
N$23  (via drill 0.55)
  Top 0.635: NEO_06.2-DOUT 18.4,78.26 arc27 16.15,76.17 v14.49,73.67
  Bottom 0.61: 13.32,71.57 NEO_07.4-DIN
  Bottom 0.635: v16.27,76.46 v15.25,74.94 v14.49,73.67 13.32,71.57
NEO_P1
  Top 0.635: NEO_01.2-DOUT 5.65,34.26 arc45 11.23,20.8 22.52,9.51 NEO_02.4-DIN
SCL  (1 unrouted)
  Top 0.203: 65.96,38.59 R1.1
  Bottom 0.203: R1.1 66.26,39.07 arc-45 67.54,42.15 69.71,44.32 arc-45 71.39,45.02 72.46,45.02 arc-45 74.16,44.32 U$1.SCL arc-45 74.18,43.11 74.18,43.09 arc45 75.01,41.09 75.72,40.38 arc45 77.52,39.63 SCL.P$1
SCL0
  Top 0.203: VEML_F.1 55.38,15.24 arc-45 54.59,13.33 R5.1 53.46,12.46 50.22,12.46 | I2C0.4 47.24,13.69 arc45 50.22,12.46 | SCL0.P$1 50.2,12.7 50.22,12.46 | 50.07,12.51 50.19,12.69 | 50.19,12.69 50.35,12.48 | 50.19,12.69 arc-45 50.22,12.61 50.22,12.46
  Bottom 0.203: U$1.SC0 77.97,49.86 arc90 76.51,51.32 64.55,51.32 arc45 61.91,50.22 56.24,44.55 arc45 54.51,40.37 54.51,33.86 arc-45 53.99,32.61 52.8,31.42 arc45 52.08,29.69 52.08,16.05 arc45 53.59,12.41 R5.1
SCL1
  Top 0.203: R8.1 84.86,41.52 arc-45 83.18,37.46 82.54,36.82 arc45 80.53,31.96 80.53,31.43 arc-45 79.63,29.26 78.53,28.16 | 78.53,28.16 72.88,22.51 I2C1.4 | SCL1.P$1 78.53,28.16
  Bottom 0.203: 87.73,44.43 VEML_B.1 arc-90 85.48,42.17 84.97,42.17 84.91,42.24 | 84.91,42.24 R8.1 | U$1.SC1 76.7,42.59 arc90 78.38,40.9 82.41,40.9 arc45 84.4,41.73 84.91,42.24
SDA  (1 unrouted)
  Top 0.203: 68.5,37 arc45 69.1,38.45 69.1,38.8 R2.1
  Bottom 0.203: R2.1 69.1,40.13 | 69.1,40.13 69.1,42.43 arc-45 69.36,43.06 70.52,44.22 arc-45 71.31,44.55 71.91,44.55 arc-90 72.89,43.57 U$1.SDA arc-45 72.91,43.11 72.91,41.37 arc45 73.42,40.14 arc45 74.64,39.63 SDA.P$1 | 69.1,40.13 69.1,38.86
SDA0
  Top 0.203: R6.1 55.36,19.29 arc45 VEML_F.4 54.81,19.25 arc45 53.08,18.54 51.8,17.26 arc-45 50.02,16.52 | I2C0.3 45.12,15.67 arc-45 47.17,16.52 50.02,16.52 | SDA0.P$1 50.02,16.52
  Bottom 0.203: U$1.SD0 76.7,49.98 arc90 75.87,50.81 64.43,50.81 arc45 62.43,49.98 59.6,47.15 arc45 57.07,41.05 57.07,33.89 arc-90 55.26,32.08 54.94,32.08 arc45 53.52,31.49 53.23,31.2 arc45 52.57,29.59 52.57,25.42 arc45 53.86,22.31 R6.1
SDA1
  Top 0.203: I2C1.3 arc-45 72.42,24.32 76.22,28.12 | 76.22,28.12 76.48,28.75 arc-45 77,30.01 77.37,30.38 arc24 81.05,36.07 arc21 82.02,41.34 R7.1 | 76.22,28.12 76.11,28.05 SDA1.P$1
  Bottom 0.203: VEML_B.4 86.95,48.33 arc45 85.23,49.05 82.87,49.05 arc45 80.99,48.27 79.11,46.39 | 79.11,46.39 arc45 77.97,43.63 U$1.SD1 | R7.1 82.02,42.4 arc45 81.25,44.24 79.11,46.39
SHDN  (1 unrouted)

### Text on the board
tNames: Moth Genus v 1.0 | Designed by Nathan Villicana-Shaw | 2019 | 12V | 3.3V | 5V | 1 | 2 | 3 | PWR | GND | 3.x | 5V | NEO | Out | 5V | 3.3V | 10k | 4.7k | 4.7k | 3.3V | GND | BCLK | DOUT | LRCL | SEL | 2.2k | 2.2k | 4.7k | SCL | SDA | GND | 3.3V | 4.7k | 3.3V | GND | SDA | SCL
bNames: GND | PWR | 5V | GND | VIN | SHDN | SEL | LRCL | DOUT | BCLK | GND | 3.3V | 4.7k | 4.7k
tValues: 660R